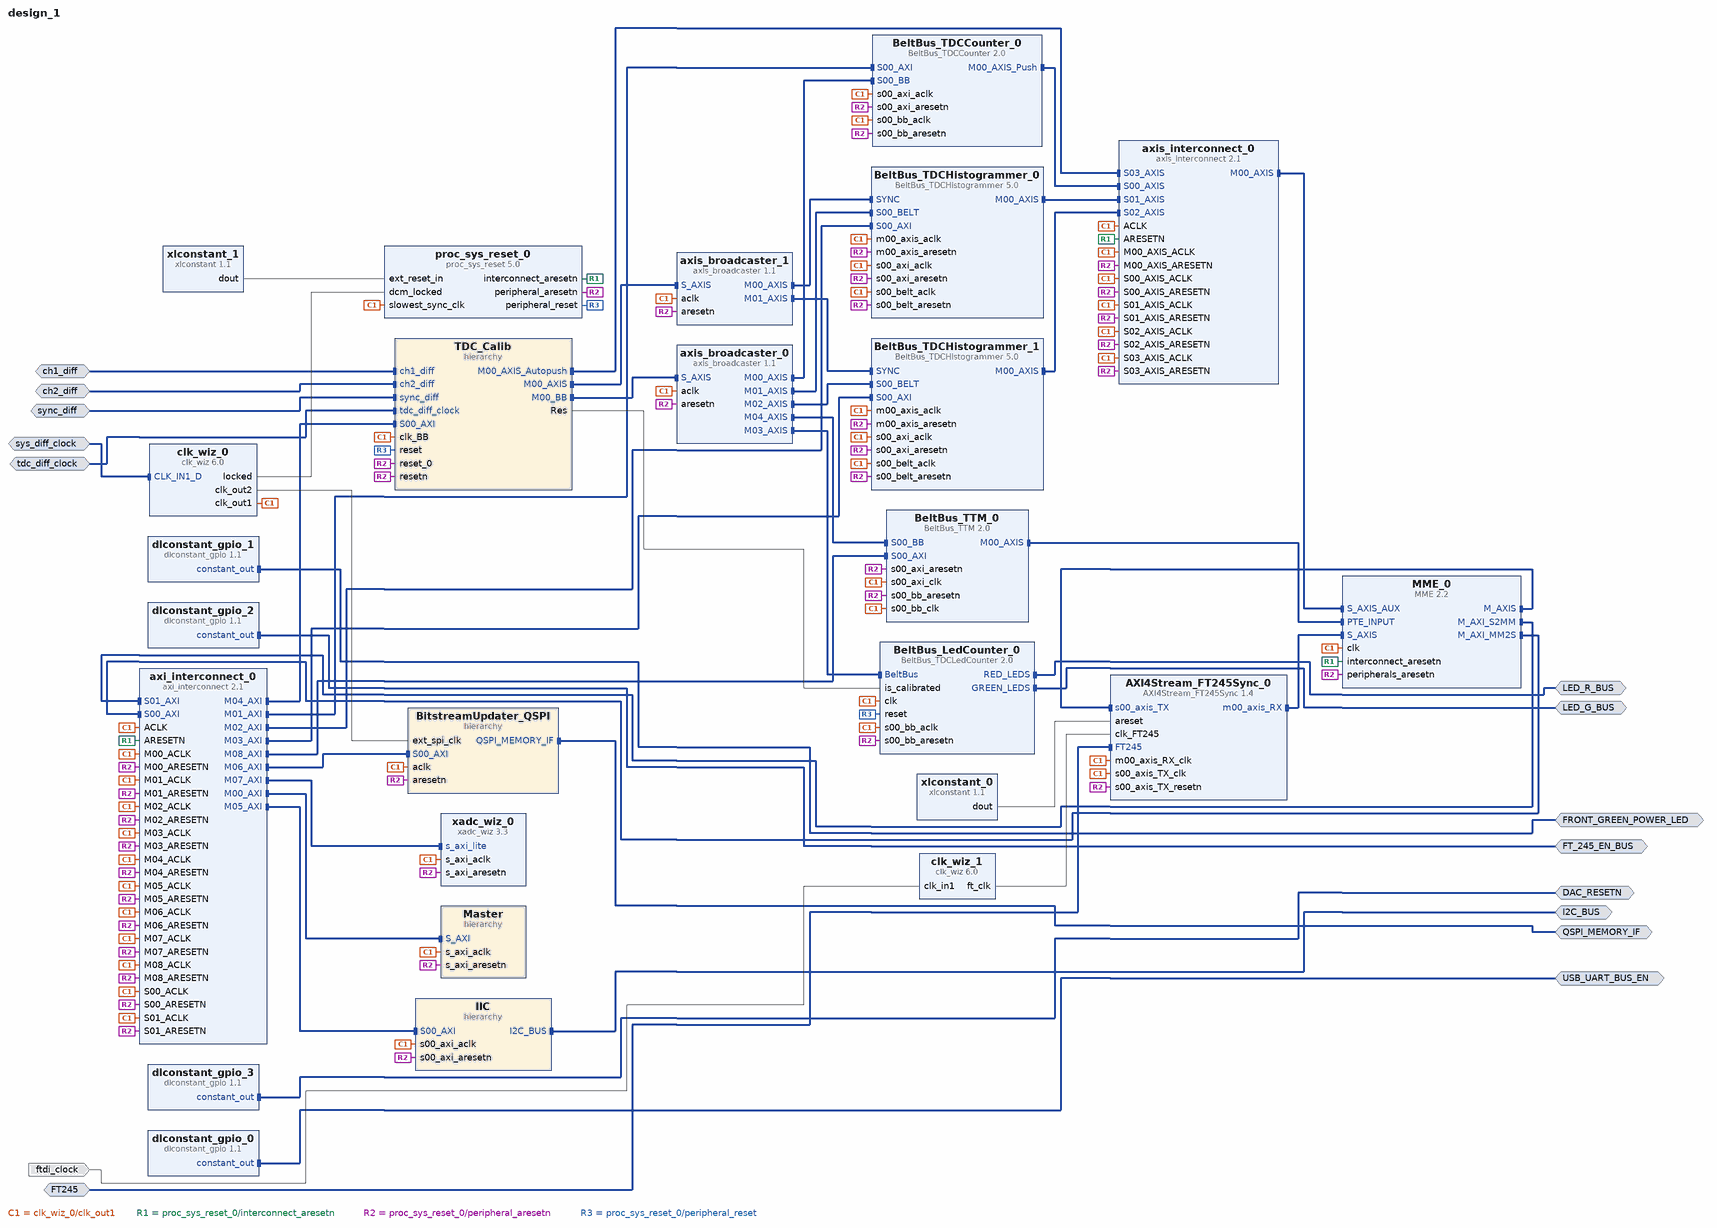
[diagram p0: block diagram of the top level]
# Vivado block design design_1, xc7a100tftg256-2, Vivado 2020.2
create_bd_design design_1

create_bd_intf_port -mode Master -vlnv xilinx.com:interface:gpio_rtl:1.0 DAC_RESETN
create_bd_intf_port -mode Master -vlnv xilinx.com:interface:gpio_rtl:1.0 FRONT_GREEN_POWER_LED
create_bd_intf_port -mode Slave -vlnv DigiLAB:if:ft245_rtl:1.2 FT245
create_bd_intf_port -mode Master -vlnv xilinx.com:interface:gpio_rtl:1.0 FT_245_EN_BUS
create_bd_intf_port -mode Master -vlnv xilinx.com:interface:iic_rtl:1.0 I2C_BUS
create_bd_intf_port -mode Master -vlnv xilinx.com:interface:gpio_rtl:1.0 LED_G_BUS
create_bd_intf_port -mode Master -vlnv xilinx.com:interface:gpio_rtl:1.0 LED_R_BUS
create_bd_intf_port -mode Master -vlnv xilinx.com:interface:spi_rtl:1.0 QSPI_MEMORY_IF
create_bd_intf_port -mode Master -vlnv xilinx.com:interface:gpio_rtl:1.0 USB_UART_BUS_EN
create_bd_intf_port -mode Slave -vlnv DigiLAB:if:diff_ch_tdc_rtl:1.1 ch1_diff
create_bd_intf_port -mode Slave -vlnv DigiLAB:if:diff_ch_tdc_rtl:1.1 ch2_diff
create_bd_intf_port -mode Slave -vlnv DigiLAB:if:diff_ch_tdc_rtl:1.1 sync_diff
create_bd_intf_port -mode Slave -vlnv xilinx.com:interface:diff_clock_rtl:1.0 sys_diff_clock
set_property -dict {CONFIG.FREQ_HZ 100000000} [get_bd_intf_ports sys_diff_clock]
create_bd_intf_port -mode Slave -vlnv xilinx.com:interface:diff_clock_rtl:1.0 tdc_diff_clock
set_property -dict {CONFIG.FREQ_HZ 416666666} [get_bd_intf_ports tdc_diff_clock]
create_bd_port -dir I -type clk ftdi_clock
set_property -dict {CONFIG.FREQ_HZ 60000000 CONFIG.PHASE 0.000} [get_bd_ports ftdi_clock]

create_bd_cell -type ip -vlnv DigiLAB:ip:AXI4Stream_FT245Sync:1.4 AXI4Stream_FT245Sync_0
set_property -dict [list \
  CONFIG.FT245_BOARD_INTERFACE FT245 \
  CONFIG.RX_BUFFER_DEPTH 512 \
  CONFIG.TX_BUFFER_DEPTH 512 \
] [get_bd_cells AXI4Stream_FT245Sync_0]
create_bd_cell -type ip -vlnv DigiLAB:ip:BeltBus_TDCLedCounter:2.0 BeltBus_LedCounter_0
set_property -dict [list \
  CONFIG.GREEN_LEDS_BOARD_INTERFACE LED_G_BUS \
  CONFIG.RED_LEDS_BOARD_INTERFACE LED_R_BUS \
] [get_bd_cells BeltBus_LedCounter_0]
create_bd_cell -type ip -vlnv DigiLAB:ip:BeltBus_TDCCounter:2.0 BeltBus_TDCCounter_0
set_property -dict {CONFIG.NUM_CH 3} [get_bd_cells BeltBus_TDCCounter_0]
create_bd_cell -type ip -vlnv DigiLAB:ip:BeltBus_TDCHistogrammer:5.0 BeltBus_TDCHistogrammer_0
set_property -dict [list \
  CONFIG.BIN_ADDR_WIDTH 13 \
  CONFIG.BIN_DATA_WIDTH 27 \
  CONFIG.BIT_OVERFLOW 16 \
  CONFIG.NUM_CH 3 \
] [get_bd_cells BeltBus_TDCHistogrammer_0]
create_bd_cell -type ip -vlnv DigiLAB:ip:BeltBus_TDCHistogrammer:5.0 BeltBus_TDCHistogrammer_1
set_property -dict [list \
  CONFIG.BIN_ADDR_WIDTH 13 \
  CONFIG.BIN_DATA_WIDTH 27 \
  CONFIG.BIT_OVERFLOW 16 \
  CONFIG.NUM_CH 3 \
] [get_bd_cells BeltBus_TDCHistogrammer_1]
create_bd_cell -type ip -vlnv DigiLAB:ip:BeltBus_TTM:2.0 BeltBus_TTM_0
set_property -dict [list \
  CONFIG.CUSTOM_TRESHOLD false \
  CONFIG.INS_TIMEOUT_CYCLES 100000000 \
  CONFIG.TAIL_FIFO_DEPTH 16384 \
  CONFIG.TLAST_GEN_TIMEOUT_CYCLES 30 \
] [get_bd_cells BeltBus_TTM_0]
create_bd_cell -type hier BitstreamUpdater_QSPI
create_bd_cell -type hier IIC
create_bd_cell -type ip -vlnv DigiLAB:hier:MME:2.2 MME_0
set_property -dict {CONFIG.MAX_PACKET_LENGTH_PACKETIZER 131072 CONFIG.PTE_AUXILIARY_PORTS true} [get_bd_cells MME_0]
create_bd_cell -type hier Master
create_bd_cell -type hier TDC_Calib
create_bd_cell -type ip -vlnv xilinx.com:ip:axi_interconnect:2.1 axi_interconnect_0
set_property -dict {CONFIG.NUM_MI 9 CONFIG.NUM_SI 2} [get_bd_cells axi_interconnect_0]
create_bd_cell -type ip -vlnv xilinx.com:ip:axis_broadcaster:1.1 axis_broadcaster_0
set_property -dict [list \
  CONFIG.HAS_TREADY 0 \
  CONFIG.M00_TDATA_REMAP {tdata[31:0]} \
  CONFIG.M01_TDATA_REMAP {tdata[31:0]} \
  CONFIG.M02_TDATA_REMAP {tdata[31:0]} \
  CONFIG.M03_TDATA_REMAP {tdata[31:0]} \
  CONFIG.M04_TDATA_REMAP {tdata[31:0]} \
  CONFIG.M_TDATA_NUM_BYTES 4 \
  CONFIG.NUM_MI 5 \
  CONFIG.S_TDATA_NUM_BYTES 4 \
] [get_bd_cells axis_broadcaster_0]
create_bd_cell -type ip -vlnv xilinx.com:ip:axis_broadcaster:1.1 axis_broadcaster_1
set_property -dict [list \
  CONFIG.HAS_TREADY 0 \
  CONFIG.M00_TDATA_REMAP {tdata[39:0]} \
  CONFIG.M01_TDATA_REMAP {tdata[39:0]} \
  CONFIG.M02_TDATA_REMAP {tdata[31:0]} \
  CONFIG.M03_TDATA_REMAP {tdata[31:0]} \
  CONFIG.M_TDATA_NUM_BYTES 5 \
  CONFIG.NUM_MI 2 \
  CONFIG.S_TDATA_NUM_BYTES 5 \
] [get_bd_cells axis_broadcaster_1]
create_bd_cell -type ip -vlnv xilinx.com:ip:axis_interconnect:2.1 axis_interconnect_0
set_property -dict {CONFIG.NUM_MI 1 CONFIG.NUM_SI 4} [get_bd_cells axis_interconnect_0]
create_bd_cell -type ip -vlnv xilinx.com:ip:clk_wiz:6.0 clk_wiz_0
set_property -dict [list \
  CONFIG.CLKOUT1_JITTER 144.719 \
  CONFIG.CLKOUT1_PHASE_ERROR 114.212 \
  CONFIG.CLKOUT2_JITTER 131.841 \
  CONFIG.CLKOUT2_PHASE_ERROR 114.212 \
  CONFIG.CLKOUT2_REQUESTED_OUT_FREQ 160.000 \
  CONFIG.CLKOUT2_USED true \
  CONFIG.CLK_IN1_BOARD_INTERFACE sys_diff_clock \
  CONFIG.MMCM_CLKFBOUT_MULT_F 8.000 \
  CONFIG.MMCM_CLKOUT0_DIVIDE_F 8.000 \
  CONFIG.MMCM_CLKOUT1_DIVIDE 5 \
  CONFIG.NUM_OUT_CLKS 2 \
  CONFIG.PRIM_SOURCE Differential_clock_capable_pin \
  CONFIG.USE_BOARD_FLOW true \
  CONFIG.USE_RESET false \
] [get_bd_cells clk_wiz_0]
create_bd_cell -type ip -vlnv xilinx.com:ip:clk_wiz:6.0 clk_wiz_1
set_property -dict [list \
  CONFIG.CLKIN1_JITTER_PS 166.66 \
  CONFIG.CLKOUT1_DRIVES BUFGCE \
  CONFIG.CLKOUT1_JITTER 165.633 \
  CONFIG.CLKOUT1_PHASE_ERROR 117.553 \
  CONFIG.CLKOUT1_REQUESTED_OUT_FREQ 60.000 \
  CONFIG.CLKOUT2_DRIVES BUFGCE \
  CONFIG.CLKOUT2_REQUESTED_OUT_FREQ 60.000 \
  CONFIG.CLKOUT3_DRIVES BUFGCE \
  CONFIG.CLKOUT3_REQUESTED_OUT_FREQ 60.000 \
  CONFIG.CLKOUT4_DRIVES BUFGCE \
  CONFIG.CLKOUT4_REQUESTED_OUT_FREQ 60.000 \
  CONFIG.CLKOUT5_DRIVES BUFGCE \
  CONFIG.CLKOUT5_REQUESTED_OUT_FREQ 60.000 \
  CONFIG.CLKOUT6_DRIVES BUFGCE \
  CONFIG.CLKOUT6_REQUESTED_OUT_FREQ 60.000 \
  CONFIG.CLKOUT7_DRIVES BUFGCE \
  CONFIG.CLKOUT7_REQUESTED_OUT_FREQ 60.000 \
  CONFIG.CLK_IN1_BOARD_INTERFACE ftdi_clock \
  CONFIG.CLK_OUT1_PORT ft_clk \
  CONFIG.FEEDBACK_SOURCE FDBK_AUTO \
  CONFIG.MMCM_CLKFBOUT_MULT_F 16.625 \
  CONFIG.MMCM_CLKIN1_PERIOD 16.667 \
  CONFIG.MMCM_CLKIN2_PERIOD 10.0 \
  CONFIG.MMCM_CLKOUT0_DIVIDE_F 16.625 \
  CONFIG.MMCM_DIVCLK_DIVIDE 1 \
  CONFIG.USE_BOARD_FLOW true \
  CONFIG.USE_FREQ_SYNTH false \
  CONFIG.USE_LOCKED false \
  CONFIG.USE_RESET false \
  CONFIG.USE_SAFE_CLOCK_STARTUP true \
] [get_bd_cells clk_wiz_1]
create_bd_cell -type ip -vlnv DigiLAB:ip:dlconstant_gpio:1.1 dlconstant_gpio_0
set_property -dict {CONFIG.CONSTANT_BOARD_INTERFACE USB_UART_BUS_EN} [get_bd_cells dlconstant_gpio_0]
create_bd_cell -type ip -vlnv DigiLAB:ip:dlconstant_gpio:1.1 dlconstant_gpio_1
set_property -dict {CONFIG.CONSTANT_BOARD_INTERFACE FRONT_GREEN_POWER_LED} [get_bd_cells dlconstant_gpio_1]
create_bd_cell -type ip -vlnv DigiLAB:ip:dlconstant_gpio:1.1 dlconstant_gpio_2
set_property -dict {CONFIG.CONSTANT_BOARD_INTERFACE FT_245_EN_BUS} [get_bd_cells dlconstant_gpio_2]
create_bd_cell -type ip -vlnv DigiLAB:ip:dlconstant_gpio:1.1 dlconstant_gpio_3
set_property -dict {CONFIG.CONSTANT_BOARD_INTERFACE DAC_RESETN} [get_bd_cells dlconstant_gpio_3]
create_bd_cell -type ip -vlnv xilinx.com:ip:proc_sys_reset:5.0 proc_sys_reset_0
create_bd_cell -type ip -vlnv xilinx.com:ip:xadc_wiz:3.3 xadc_wiz_0
set_property -dict [list \
  CONFIG.ACQUISITION_TIME 4 \
  CONFIG.ADC_CONVERSION_RATE 39 \
  CONFIG.CHANNEL_AVERAGING 256 \
  CONFIG.CHANNEL_ENABLE_TEMPERATURE true \
  CONFIG.CHANNEL_ENABLE_VP_VN false \
  CONFIG.DCLK_FREQUENCY 8 \
  CONFIG.EXTERNAL_MUX_CHANNEL VP_VN \
  CONFIG.OT_ALARM false \
  CONFIG.SEQUENCER_MODE Continuous \
  CONFIG.SINGLE_CHANNEL_ACQUISITION_TIME false \
  CONFIG.SINGLE_CHANNEL_ENABLE_CALIBRATION true \
  CONFIG.SINGLE_CHANNEL_SELECTION VP_VN \
  CONFIG.USER_TEMP_ALARM false \
  CONFIG.VCCAUX_ALARM false \
  CONFIG.VCCINT_ALARM false \
  CONFIG.XADC_STARUP_SELECTION channel_sequencer \
] [get_bd_cells xadc_wiz_0]
create_bd_cell -type ip -vlnv xilinx.com:ip:xlconstant:1.1 xlconstant_0
set_property -dict {CONFIG.CONST_VAL 0} [get_bd_cells xlconstant_0]
create_bd_cell -type ip -vlnv xilinx.com:ip:xlconstant:1.1 xlconstant_1
set_property -dict {CONFIG.CONST_VAL 1} [get_bd_cells xlconstant_1]

# ---- hierarchy /BitstreamUpdater_QSPI ----
current_bd_instance /BitstreamUpdater_QSPI
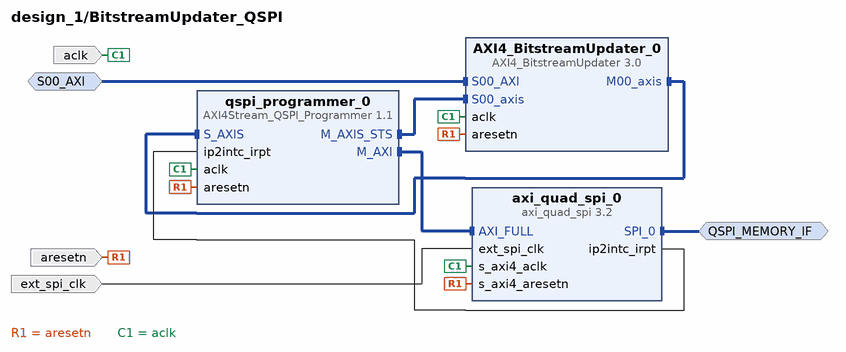
[diagram p1: block diagram inside /BitstreamUpdater_QSPI]
create_bd_intf_pin -mode Master -vlnv xilinx.com:interface:spi_rtl:1.0 QSPI_MEMORY_IF
create_bd_intf_pin -mode Slave -vlnv xilinx.com:interface:aximm_rtl:1.0 S00_AXI
create_bd_pin -dir I -type clk aclk
create_bd_pin -dir I -type rst aresetn
create_bd_pin -dir I -type clk ext_spi_clk

create_bd_cell -type ip -vlnv DigiLAB:ip:AXI4_BitstreamUpdater:3.0 AXI4_BitstreamUpdater_0
create_bd_cell -type ip -vlnv xilinx.com:ip:axi_quad_spi:3.2 axi_quad_spi_0
set_property -dict [list \
  CONFIG.C_FIFO_DEPTH 256 \
  CONFIG.C_SPI_MEMORY 3 \
  CONFIG.C_SPI_MODE 2 \
  CONFIG.C_TYPE_OF_AXI4_INTERFACE 1 \
  CONFIG.QSPI_BOARD_INTERFACE QSPI_MEMORY_IF \
  CONFIG.USE_BOARD_FLOW true \
] [get_bd_cells axi_quad_spi_0]
create_bd_cell -type ip -vlnv DigiLAB:ip:AXI4Stream_QSPI_Programmer:1.1 qspi_programmer_0
set_property -dict [list \
  CONFIG.END_ADDRESS 0x007F0000 \
  CONFIG.MEMORY_CODE S25FLxL \
  CONFIG.MEMORY_SIZE 64 \
  CONFIG.START_ADDRESS 0x00400000 \
] [get_bd_cells qspi_programmer_0]

# ---- hierarchy /IIC ----
current_bd_instance /IIC
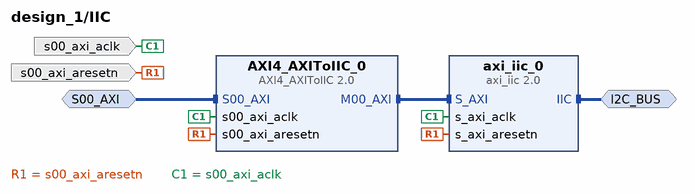
[diagram p2: block diagram inside /IIC]
create_bd_intf_pin -mode Master -vlnv xilinx.com:interface:iic_rtl:1.0 I2C_BUS
create_bd_intf_pin -mode Slave -vlnv xilinx.com:interface:aximm_rtl:1.0 S00_AXI
create_bd_pin -dir I -type clk s00_axi_aclk
create_bd_pin -dir I -type rst s00_axi_aresetn

create_bd_cell -type ip -vlnv DigiLAB:ip:AXI4_AXIToIIC:2.0 AXI4_AXIToIIC_0
create_bd_cell -type ip -vlnv xilinx.com:ip:axi_iic:2.0 axi_iic_0
set_property -dict {CONFIG.IIC_BOARD_INTERFACE I2C_BUS CONFIG.USE_BOARD_FLOW true} [get_bd_cells axi_iic_0]

# ---- hierarchy /Master ----
current_bd_instance /Master
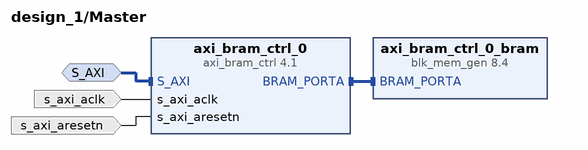
[diagram p3: block diagram inside /Master]
create_bd_intf_pin -mode Slave -vlnv xilinx.com:interface:aximm_rtl:1.0 S_AXI
create_bd_pin -dir I -type clk s_axi_aclk
create_bd_pin -dir I -type rst s_axi_aresetn

create_bd_cell -type ip -vlnv xilinx.com:ip:axi_bram_ctrl:4.1 axi_bram_ctrl_0
set_property -dict {CONFIG.SINGLE_PORT_BRAM 1} [get_bd_cells axi_bram_ctrl_0]
create_bd_cell -type ip -vlnv xilinx.com:ip:blk_mem_gen:8.4 axi_bram_ctrl_0_bram
set_property -dict [list \
  CONFIG.Coe_File ../../../../../../../../../master_v70.coe \
  CONFIG.Load_Init_File true \
  CONFIG.Memory_Type Single_Port_ROM \
  CONFIG.Port_A_Write_Rate 0 \
] [get_bd_cells axi_bram_ctrl_0_bram]

# ---- hierarchy /TDC_Calib ----
current_bd_instance /TDC_Calib
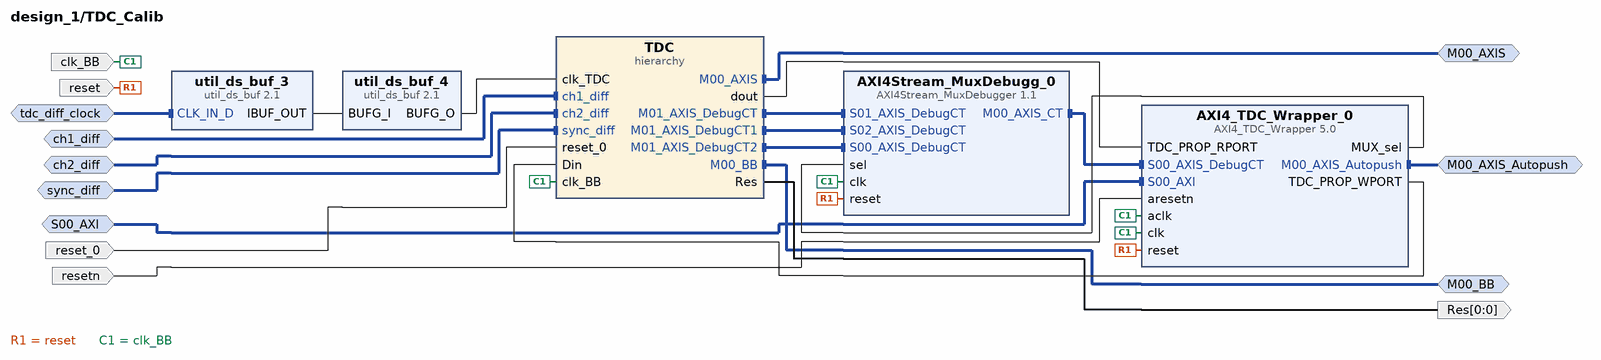
[diagram p4: block diagram inside /TDC_Calib]
create_bd_intf_pin -mode Master -vlnv xilinx.com:interface:axis_rtl:1.0 M00_AXIS
create_bd_intf_pin -mode Master -vlnv xilinx.com:interface:axis_rtl:1.0 M00_AXIS_Autopush
create_bd_intf_pin -mode Master -vlnv xilinx.com:interface:axis_rtl:1.0 M00_BB
create_bd_intf_pin -mode Slave -vlnv xilinx.com:interface:aximm_rtl:1.0 S00_AXI
create_bd_intf_pin -mode Slave -vlnv DigiLAB:if:diff_ch_tdc_rtl:1.1 ch1_diff
create_bd_intf_pin -mode Slave -vlnv DigiLAB:if:diff_ch_tdc_rtl:1.1 ch2_diff
create_bd_intf_pin -mode Slave -vlnv DigiLAB:if:diff_ch_tdc_rtl:1.1 sync_diff
create_bd_intf_pin -mode Slave -vlnv xilinx.com:interface:diff_clock_rtl:1.0 tdc_diff_clock
create_bd_pin -dir O -from 0 -to 0 Res
create_bd_pin -dir I -type clk clk_BB
create_bd_pin -dir I -type rst reset
create_bd_pin -dir I -type rst reset_0
create_bd_pin -dir I -type rst resetn

create_bd_cell -type ip -vlnv DigiLAB:ip:AXI4Stream_MuxDebugger:1.1 AXI4Stream_MuxDebugg_0
set_property -dict {CONFIG.DEBUG_MODE_CC false CONFIG.NUM_CHANNEL 3} [get_bd_cells AXI4Stream_MuxDebugg_0]
create_bd_cell -type ip -vlnv DigiLAB:ip:AXI4_TDC_Wrapper:5.0 AXI4_TDC_Wrapper_0
set_property -dict [list \
  CONFIG.BIT_CALIBRATION 24 \
  CONFIG.BIT_RESOLUTION 16 \
  CONFIG.BIT_UNCALIBRATED 10 \
  CONFIG.C_S00_AXI_ADDR_ABS 0x44A40000 \
  CONFIG.DEBUG_MODE_CC false \
  CONFIG.DEF_CH_STRETCHERLENGTH 6 \
  CONFIG.DEF_SYNC_STRETCHERLENGTH 1 \
  CONFIG.PW_StretcherLength 3 \
  CONFIG.TDC_CH_RPORT_WIDTH 65 \
  CONFIG.TDC_ENABLE_DEBUG_PORTS false \
] [get_bd_cells AXI4_TDC_Wrapper_0]
create_bd_cell -type hier TDC
create_bd_cell -type ip -vlnv xilinx.com:ip:util_ds_buf:2.1 util_ds_buf_3
set_property -dict {CONFIG.DIFF_CLK_IN_BOARD_INTERFACE tdc_diff_clock CONFIG.USE_BOARD_FLOW true} [get_bd_cells util_ds_buf_3]
create_bd_cell -type ip -vlnv xilinx.com:ip:util_ds_buf:2.1 util_ds_buf_4
set_property -dict {CONFIG.C_BUF_TYPE BUFG} [get_bd_cells util_ds_buf_4]

# ---- hierarchy /TDC_Calib/TDC ----
current_bd_instance /TDC_Calib/TDC
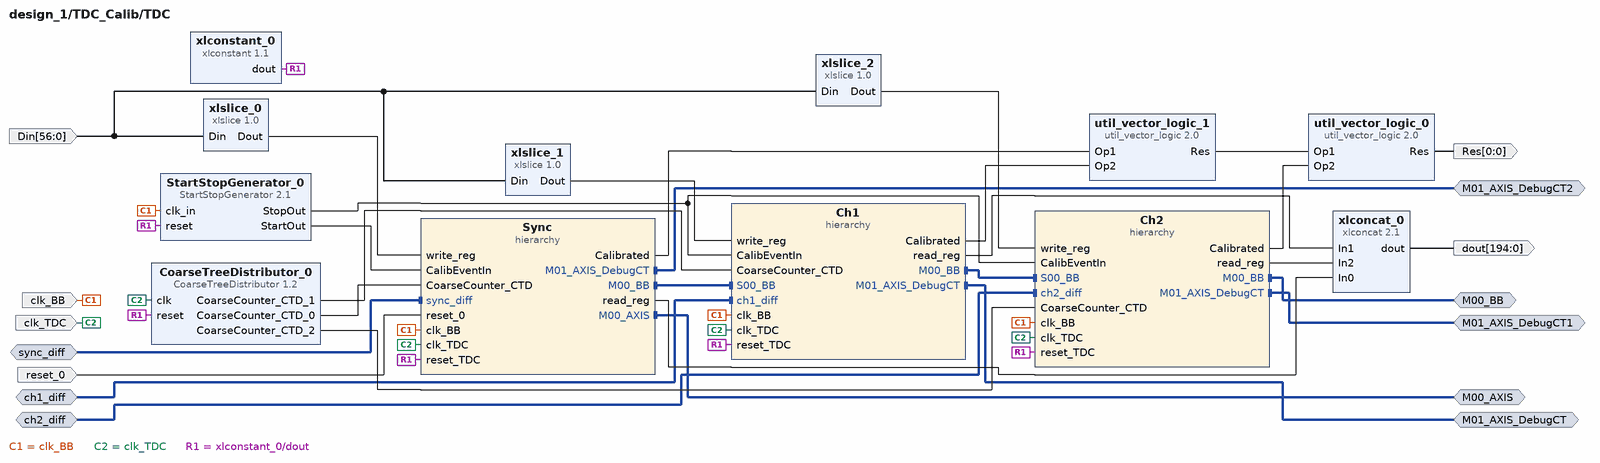
[diagram p5: block diagram inside /TDC_Calib/TDC]
create_bd_intf_pin -mode Master -vlnv xilinx.com:interface:axis_rtl:1.0 M00_AXIS
create_bd_intf_pin -mode Master -vlnv xilinx.com:interface:axis_rtl:1.0 M00_BB
create_bd_intf_pin -mode Master -vlnv xilinx.com:interface:axis_rtl:1.0 M01_AXIS_DebugCT
create_bd_intf_pin -mode Master -vlnv xilinx.com:interface:axis_rtl:1.0 M01_AXIS_DebugCT1
create_bd_intf_pin -mode Master -vlnv xilinx.com:interface:axis_rtl:1.0 M01_AXIS_DebugCT2
create_bd_intf_pin -mode Slave -vlnv DigiLAB:if:diff_ch_tdc_rtl:1.1 ch1_diff
create_bd_intf_pin -mode Slave -vlnv DigiLAB:if:diff_ch_tdc_rtl:1.1 ch2_diff
create_bd_intf_pin -mode Slave -vlnv DigiLAB:if:diff_ch_tdc_rtl:1.1 sync_diff
create_bd_pin -dir I -from 56 -to 0 Din
create_bd_pin -dir O -from 0 -to 0 Res
create_bd_pin -dir I -type clk clk_BB
create_bd_pin -dir I -type clk clk_TDC
create_bd_pin -dir O -from 194 -to 0 dout
create_bd_pin -dir I -type rst reset_0

create_bd_cell -type hier Ch1
create_bd_cell -type hier Ch2
create_bd_cell -type ip -vlnv DigiLAB:ip:CoarseTreeDistributor:1.2 CoarseTreeDistributor_0
set_property -dict {CONFIG.NUMBER_OF_OUTPUT 3} [get_bd_cells CoarseTreeDistributor_0]
create_bd_cell -type ip -vlnv DigiLAB:ip:StartStopGenerator:2.1 StartStopGenerator_0
set_property -dict {CONFIG.CLK_SELECT EXTERNAL CONFIG.HALF_DIVIDER 5 CONFIG.TUNING_MODE false} [get_bd_cells StartStopGenerator_0]
create_bd_cell -type hier Sync
create_bd_cell -type ip -vlnv xilinx.com:ip:util_vector_logic:2.0 util_vector_logic_0
set_property -dict {CONFIG.C_SIZE 1} [get_bd_cells util_vector_logic_0]
create_bd_cell -type ip -vlnv xilinx.com:ip:util_vector_logic:2.0 util_vector_logic_1
set_property -dict {CONFIG.C_SIZE 1} [get_bd_cells util_vector_logic_1]
create_bd_cell -type ip -vlnv xilinx.com:ip:xlconcat:2.1 xlconcat_0
set_property -dict {CONFIG.IN0_WIDTH 65 CONFIG.IN1_WIDTH 65 CONFIG.IN2_WIDTH 65 CONFIG.NUM_PORTS 3} [get_bd_cells xlconcat_0]
create_bd_cell -type ip -vlnv xilinx.com:ip:xlconstant:1.1 xlconstant_0
set_property -dict {CONFIG.CONST_VAL 0} [get_bd_cells xlconstant_0]
create_bd_cell -type ip -vlnv xilinx.com:ip:xlslice:1.0 xlslice_0
set_property -dict {CONFIG.DIN_FROM 18 CONFIG.DIN_WIDTH 57 CONFIG.DOUT_WIDTH 19} [get_bd_cells xlslice_0]
create_bd_cell -type ip -vlnv xilinx.com:ip:xlslice:1.0 xlslice_1
set_property -dict {CONFIG.DIN_FROM 37 CONFIG.DIN_TO 19 CONFIG.DIN_WIDTH 57 CONFIG.DOUT_WIDTH 19} [get_bd_cells xlslice_1]
create_bd_cell -type ip -vlnv xilinx.com:ip:xlslice:1.0 xlslice_2
set_property -dict {CONFIG.DIN_FROM 56 CONFIG.DIN_TO 38 CONFIG.DIN_WIDTH 57 CONFIG.DOUT_WIDTH 19} [get_bd_cells xlslice_2]

# ---- hierarchy /TDC_Calib/TDC/Ch1 ----
current_bd_instance /TDC_Calib/TDC/Ch1
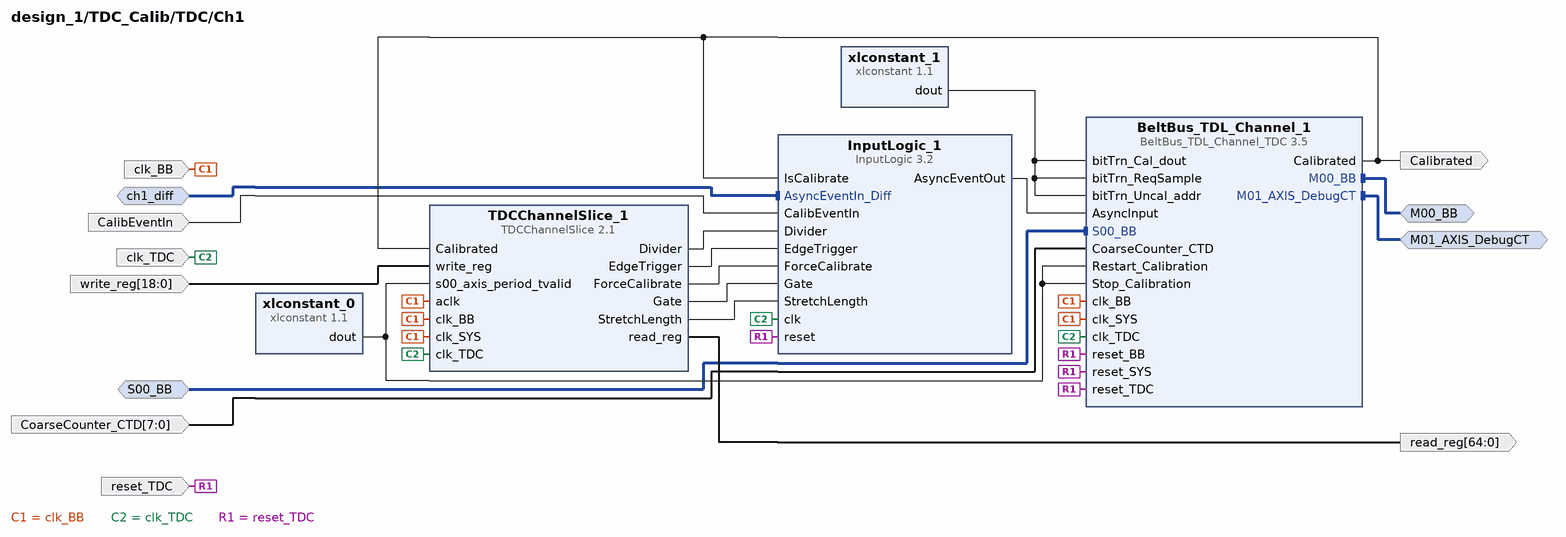
[diagram p6: block diagram inside /TDC_Calib/TDC/Ch1]
create_bd_intf_pin -mode Master -vlnv xilinx.com:interface:axis_rtl:1.0 M00_BB
create_bd_intf_pin -mode Master -vlnv xilinx.com:interface:axis_rtl:1.0 M01_AXIS_DebugCT
create_bd_intf_pin -mode Slave -vlnv xilinx.com:interface:axis_rtl:1.0 S00_BB
create_bd_intf_pin -mode Slave -vlnv DigiLAB:if:diff_ch_tdc_rtl:1.1 ch1_diff
create_bd_pin -dir I -type data CalibEventIn
create_bd_pin -dir O -type data Calibrated
create_bd_pin -dir I -from 7 -to 0 CoarseCounter_CTD
create_bd_pin -dir I -type clk clk_BB
create_bd_pin -dir I -type clk clk_TDC
create_bd_pin -dir O -from 64 -to 0 -type data read_reg
create_bd_pin -dir I -type rst reset_TDC
create_bd_pin -dir I -from 18 -to 0 -type data write_reg

create_bd_cell -type ip -vlnv DigiLAB:hier:BeltBus_TDL_Channel_TDC:3.5 BeltBus_TDL_Channel_1
set_property -dict [list \
  CONFIG.BIT_SMP_PRE_TDL 0 \
  CONFIG.BIT_UNCALIBRATED 10 \
  CONFIG.CEC_VS_CTD_COUNTER CTD \
  CONFIG.DEBUG_MODE false \
  CONFIG.DEBUG_MODE_CT true \
  CONFIG.DEBUG_PORT_DECODER false \
  CONFIG.NUMBER_OF_TDL 4 \
  CONFIG.NUM_CH 1 \
  CONFIG.NUM_NODE 1 \
  CONFIG.NUM_TAP_PRE_TDL 0 \
] [get_bd_cells BeltBus_TDL_Channel_1]
create_bd_cell -type ip -vlnv DigiLAB:ip:InputLogic:3.2 InputLogic_1
set_property -dict [list \
  CONFIG.BIT_DIVIDER 4 \
  CONFIG.BIT_STRETCH_LENGTH 3 \
  CONFIG.CALIB_EVENT EXTERNAL \
  CONFIG.DIVIDER_INIT 0 \
  CONFIG.EDGE_TRIGGER_INIT RISE \
  CONFIG.INPUT_DIFF_CH_TDC_BOARD_INTERFACE ch1_diff \
  CONFIG.INVERT_BUFFER_POLARITY true \
  CONFIG.STRETCH_LENGTH_INIT 6 \
  CONFIG.TUNING_MODE true \
] [get_bd_cells InputLogic_1]
create_bd_cell -type ip -vlnv DigiLAB:ip:TDCChannelSlice:2.1 TDCChannelSlice_1
set_property -dict {CONFIG.BIT_DIVIDER 4 CONFIG.TDC_ENABLE_DEBUG_PORTS false} [get_bd_cells TDCChannelSlice_1]
create_bd_cell -type ip -vlnv xilinx.com:ip:xlconstant:1.1 xlconstant_0
set_property -dict {CONFIG.CONST_VAL 0} [get_bd_cells xlconstant_0]
create_bd_cell -type ip -vlnv xilinx.com:ip:xlconstant:1.1 xlconstant_1
set_property -dict {CONFIG.CONST_VAL 0 CONFIG.CONST_WIDTH 32} [get_bd_cells xlconstant_1]

# ---- hierarchy /TDC_Calib/TDC/Ch2 ----
current_bd_instance /TDC_Calib/TDC/Ch2
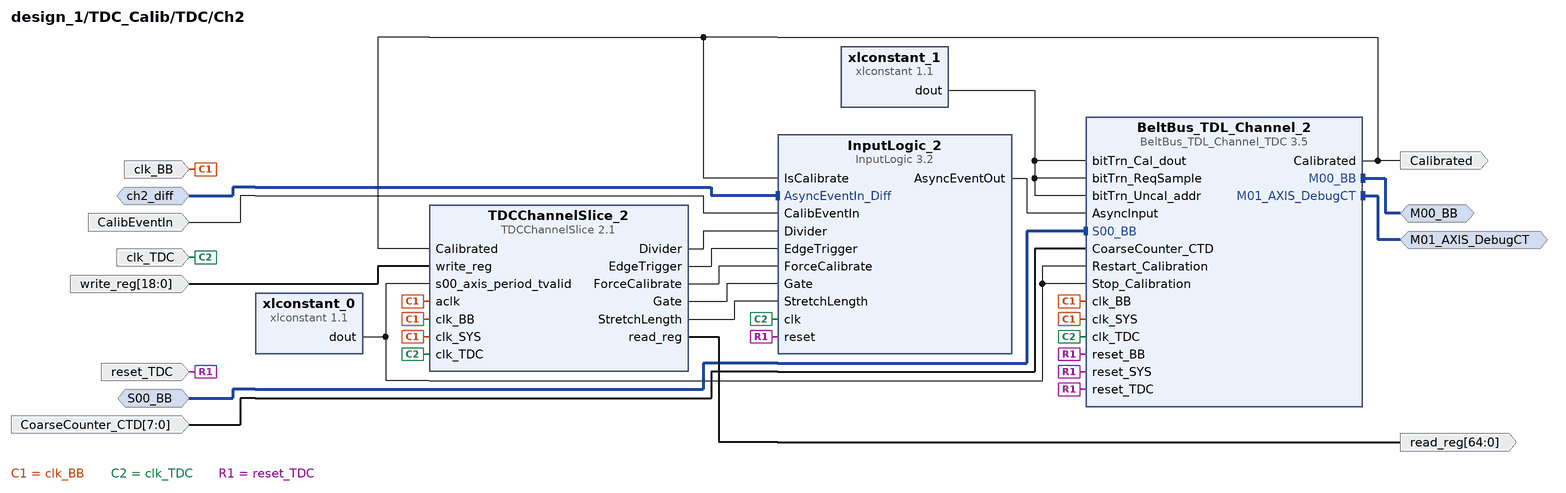
[diagram p7: block diagram inside /TDC_Calib/TDC/Ch2]
create_bd_intf_pin -mode Master -vlnv xilinx.com:interface:axis_rtl:1.0 M00_BB
create_bd_intf_pin -mode Master -vlnv xilinx.com:interface:axis_rtl:1.0 M01_AXIS_DebugCT
create_bd_intf_pin -mode Slave -vlnv xilinx.com:interface:axis_rtl:1.0 S00_BB
create_bd_intf_pin -mode Slave -vlnv DigiLAB:if:diff_ch_tdc_rtl:1.1 ch2_diff
create_bd_pin -dir I -type data CalibEventIn
create_bd_pin -dir O -type data Calibrated
create_bd_pin -dir I -from 7 -to 0 CoarseCounter_CTD
create_bd_pin -dir I -type clk clk_BB
create_bd_pin -dir I -type clk clk_TDC
create_bd_pin -dir O -from 64 -to 0 -type data read_reg
create_bd_pin -dir I -type rst reset_TDC
create_bd_pin -dir I -from 18 -to 0 -type data write_reg

create_bd_cell -type ip -vlnv DigiLAB:hier:BeltBus_TDL_Channel_TDC:3.5 BeltBus_TDL_Channel_2
set_property -dict [list \
  CONFIG.BIT_SMP_PRE_TDL 0 \
  CONFIG.BIT_UNCALIBRATED 10 \
  CONFIG.CEC_VS_CTD_COUNTER CTD \
  CONFIG.DEBUG_MODE false \
  CONFIG.DEBUG_MODE_CT true \
  CONFIG.DEBUG_PORT_DECODER false \
  CONFIG.NUMBER_OF_TDL 4 \
  CONFIG.NUM_CH 2 \
  CONFIG.NUM_NODE 2 \
  CONFIG.NUM_TAP_PRE_TDL 0 \
] [get_bd_cells BeltBus_TDL_Channel_2]
create_bd_cell -type ip -vlnv DigiLAB:ip:InputLogic:3.2 InputLogic_2
set_property -dict [list \
  CONFIG.BIT_DIVIDER 4 \
  CONFIG.BIT_STRETCH_LENGTH 3 \
  CONFIG.CALIB_EVENT EXTERNAL \
  CONFIG.DIVIDER_INIT 0 \
  CONFIG.EDGE_TRIGGER_INIT RISE \
  CONFIG.INPUT_DIFF_CH_TDC_BOARD_INTERFACE ch2_diff \
  CONFIG.INVERT_BUFFER_POLARITY true \
  CONFIG.STRETCH_LENGTH_INIT 6 \
  CONFIG.TUNING_MODE true \
] [get_bd_cells InputLogic_2]
create_bd_cell -type ip -vlnv DigiLAB:ip:TDCChannelSlice:2.1 TDCChannelSlice_2
set_property -dict {CONFIG.BIT_DIVIDER 4 CONFIG.TDC_ENABLE_DEBUG_PORTS false} [get_bd_cells TDCChannelSlice_2]
create_bd_cell -type ip -vlnv xilinx.com:ip:xlconstant:1.1 xlconstant_0
set_property -dict {CONFIG.CONST_VAL 0} [get_bd_cells xlconstant_0]
create_bd_cell -type ip -vlnv xilinx.com:ip:xlconstant:1.1 xlconstant_1
set_property -dict {CONFIG.CONST_VAL 0 CONFIG.CONST_WIDTH 32} [get_bd_cells xlconstant_1]

# ---- hierarchy /TDC_Calib/TDC/Sync ----
current_bd_instance /TDC_Calib/TDC/Sync
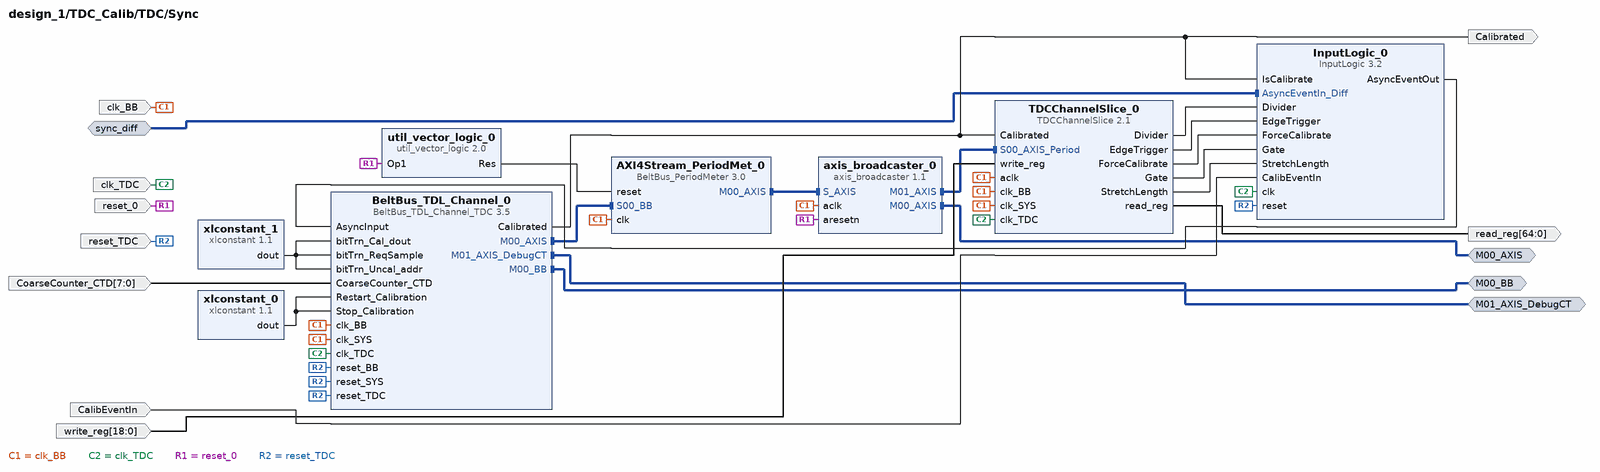
[diagram p8: block diagram inside /TDC_Calib/TDC/Sync]
create_bd_intf_pin -mode Master -vlnv xilinx.com:interface:axis_rtl:1.0 M00_AXIS
create_bd_intf_pin -mode Master -vlnv xilinx.com:interface:axis_rtl:1.0 M00_BB
create_bd_intf_pin -mode Master -vlnv xilinx.com:interface:axis_rtl:1.0 M01_AXIS_DebugCT
create_bd_intf_pin -mode Slave -vlnv DigiLAB:if:diff_ch_tdc_rtl:1.1 sync_diff
create_bd_pin -dir I -type data CalibEventIn
create_bd_pin -dir O -type data Calibrated
create_bd_pin -dir I -from 7 -to 0 CoarseCounter_CTD
create_bd_pin -dir I -type clk clk_BB
create_bd_pin -dir I -type clk clk_TDC
create_bd_pin -dir O -from 64 -to 0 -type data read_reg
create_bd_pin -dir I -type rst reset_0
create_bd_pin -dir I -type rst reset_TDC
create_bd_pin -dir I -from 18 -to 0 -type data write_reg

create_bd_cell -type ip -vlnv DigiLAB:ip:BeltBus_PeriodMeter:3.0 AXI4Stream_PeriodMet_0
set_property -dict {CONFIG.BIT_COARSE 8 CONFIG.BIT_OVERFLOW 16} [get_bd_cells AXI4Stream_PeriodMet_0]
create_bd_cell -type ip -vlnv DigiLAB:hier:BeltBus_TDL_Channel_TDC:3.5 BeltBus_TDL_Channel_0
set_property -dict [list \
  CONFIG.BIT_SMP_PRE_TDL 0 \
  CONFIG.BIT_UNCALIBRATED 10 \
  CONFIG.CEC_VS_CTD_COUNTER CTD \
  CONFIG.DEBUG_MODE false \
  CONFIG.DEBUG_MODE_CT true \
  CONFIG.DEBUG_PORT_DECODER false \
  CONFIG.NUMBER_OF_TDL 4 \
  CONFIG.NUM_TAP_PRE_TDL 0 \
  CONFIG.PASS_THROUGH Both \
] [get_bd_cells BeltBus_TDL_Channel_0]
create_bd_cell -type ip -vlnv DigiLAB:ip:InputLogic:3.2 InputLogic_0
set_property -dict [list \
  CONFIG.BIT_DIVIDER 4 \
  CONFIG.BIT_STRETCH_LENGTH 3 \
  CONFIG.CALIB_EVENT EXTERNAL \
  CONFIG.DIVIDER_INIT 15 \
  CONFIG.INPUT_DIFF_CH_TDC_BOARD_INTERFACE sync_diff \
  CONFIG.STRETCH_LENGTH_INIT 6 \
  CONFIG.TUNING_MODE true \
] [get_bd_cells InputLogic_0]
create_bd_cell -type ip -vlnv DigiLAB:ip:TDCChannelSlice:2.1 TDCChannelSlice_0
set_property -dict [list \
  CONFIG.BIT_DIVIDER 4 \
  CONFIG.BIT_OVERFLOW 16 \
  CONFIG.TDC_ENABLE_DEBUG_PORTS false \
] [get_bd_cells TDCChannelSlice_0]
create_bd_cell -type ip -vlnv xilinx.com:ip:axis_broadcaster:1.1 axis_broadcaster_0
set_property -dict [list \
  CONFIG.HAS_TREADY 0 \
  CONFIG.M00_TDATA_REMAP {tdata[39:0]} \
  CONFIG.M01_TDATA_REMAP {tdata[39:0]} \
  CONFIG.M_TDATA_NUM_BYTES 5 \
  CONFIG.S_TDATA_NUM_BYTES 5 \
] [get_bd_cells axis_broadcaster_0]
create_bd_cell -type ip -vlnv xilinx.com:ip:util_vector_logic:2.0 util_vector_logic_0
set_property -dict {CONFIG.C_OPERATION not CONFIG.C_SIZE 1} [get_bd_cells util_vector_logic_0]
create_bd_cell -type ip -vlnv xilinx.com:ip:xlconstant:1.1 xlconstant_0
set_property -dict {CONFIG.CONST_VAL 0} [get_bd_cells xlconstant_0]
create_bd_cell -type ip -vlnv xilinx.com:ip:xlconstant:1.1 xlconstant_1
set_property -dict {CONFIG.CONST_VAL 0 CONFIG.CONST_WIDTH 32} [get_bd_cells xlconstant_1]

# ---- connections ----

current_bd_instance /BitstreamUpdater_QSPI
connect_bd_intf_net [get_bd_intf_pins AXI4_BitstreamUpdater_0/M00_axis] [get_bd_intf_pins qspi_programmer_0/S_AXIS]
connect_bd_intf_net -intf_net axi_interconnect_0_M06_AXI [get_bd_intf_pins S00_AXI] [get_bd_intf_pins AXI4_BitstreamUpdater_0/S00_AXI]
connect_bd_intf_net [get_bd_intf_pins axi_quad_spi_0/AXI_FULL] [get_bd_intf_pins qspi_programmer_0/M_AXI]
connect_bd_intf_net [get_bd_intf_pins QSPI_MEMORY_IF] [get_bd_intf_pins axi_quad_spi_0/SPI_0]
connect_bd_intf_net [get_bd_intf_pins AXI4_BitstreamUpdater_0/S00_axis] [get_bd_intf_pins qspi_programmer_0/M_AXIS_STS]
connect_bd_net [get_bd_pins aresetn] \
  [get_bd_pins AXI4_BitstreamUpdater_0/aresetn] [get_bd_pins axi_quad_spi_0/s_axi4_aresetn] \
  [get_bd_pins qspi_programmer_0/aresetn]
connect_bd_net [get_bd_pins axi_quad_spi_0/ip2intc_irpt] [get_bd_pins qspi_programmer_0/ip2intc_irpt]
connect_bd_net -net clk_wiz_0_clk_out1 [get_bd_pins aclk] \
  [get_bd_pins AXI4_BitstreamUpdater_0/aclk] [get_bd_pins axi_quad_spi_0/s_axi4_aclk] [get_bd_pins qspi_programmer_0/aclk]
connect_bd_net -net clk_wiz_0_clk_out2 [get_bd_pins ext_spi_clk] [get_bd_pins axi_quad_spi_0/ext_spi_clk]

current_bd_instance /IIC
connect_bd_intf_net [get_bd_intf_pins AXI4_AXIToIIC_0/M00_AXI] [get_bd_intf_pins axi_iic_0/S_AXI]
connect_bd_intf_net [get_bd_intf_pins I2C_BUS] [get_bd_intf_pins axi_iic_0/IIC]
connect_bd_intf_net -intf_net axi_interconnect_0_M05_AXI [get_bd_intf_pins S00_AXI] [get_bd_intf_pins AXI4_AXIToIIC_0/S00_AXI]
connect_bd_net -net M05_ARESETN_1 [get_bd_pins s00_axi_aresetn] [get_bd_pins AXI4_AXIToIIC_0/s00_axi_aresetn] [get_bd_pins axi_iic_0/s_axi_aresetn]
connect_bd_net -net clk_wiz_0_clk_out1 [get_bd_pins s00_axi_aclk] [get_bd_pins AXI4_AXIToIIC_0/s00_axi_aclk] [get_bd_pins axi_iic_0/s_axi_aclk]

current_bd_instance /Master
connect_bd_intf_net [get_bd_intf_pins axi_bram_ctrl_0/BRAM_PORTA] [get_bd_intf_pins axi_bram_ctrl_0_bram/BRAM_PORTA]
connect_bd_intf_net -intf_net axi_interconnect_0_M01_AXI [get_bd_intf_pins S_AXI] [get_bd_intf_pins axi_bram_ctrl_0/S_AXI]
connect_bd_net -net clk_wiz_0_clk_out1 [get_bd_pins s_axi_aclk] [get_bd_pins axi_bram_ctrl_0/s_axi_aclk]
connect_bd_net -net proc_sys_reset_0_peripheral_aresetn [get_bd_pins s_axi_aresetn] [get_bd_pins axi_bram_ctrl_0/s_axi_aresetn]

current_bd_instance /TDC_Calib
connect_bd_intf_net [get_bd_intf_pins AXI4Stream_MuxDebugg_0/M00_AXIS_CT] [get_bd_intf_pins AXI4_TDC_Wrapper_0/S00_AXIS_DebugCT]
connect_bd_intf_net [get_bd_intf_pins M00_AXIS_Autopush] [get_bd_intf_pins AXI4_TDC_Wrapper_0/M00_AXIS_Autopush]
connect_bd_intf_net [get_bd_intf_pins M00_AXIS] [get_bd_intf_pins TDC/M00_AXIS]
connect_bd_intf_net [get_bd_intf_pins S00_AXI] [get_bd_intf_pins AXI4_TDC_Wrapper_0/S00_AXI]
connect_bd_intf_net [get_bd_intf_pins M00_BB] [get_bd_intf_pins TDC/M00_BB]
connect_bd_intf_net [get_bd_intf_pins AXI4Stream_MuxDebugg_0/S01_AXIS_DebugCT] [get_bd_intf_pins TDC/M01_AXIS_DebugCT]
connect_bd_intf_net [get_bd_intf_pins AXI4Stream_MuxDebugg_0/S02_AXIS_DebugCT] [get_bd_intf_pins TDC/M01_AXIS_DebugCT1]
connect_bd_intf_net [get_bd_intf_pins AXI4Stream_MuxDebugg_0/S00_AXIS_DebugCT] [get_bd_intf_pins TDC/M01_AXIS_DebugCT2]
connect_bd_intf_net [get_bd_intf_pins ch1_diff] [get_bd_intf_pins TDC/ch1_diff]
connect_bd_intf_net [get_bd_intf_pins ch2_diff] [get_bd_intf_pins TDC/ch2_diff]
connect_bd_intf_net [get_bd_intf_pins sync_diff] [get_bd_intf_pins TDC/sync_diff]
connect_bd_intf_net [get_bd_intf_pins tdc_diff_clock] [get_bd_intf_pins util_ds_buf_3/CLK_IN_D]
connect_bd_net [get_bd_pins AXI4_TDC_Wrapper_0/MUX_sel] [get_bd_pins AXI4Stream_MuxDebugg_0/sel]
connect_bd_net [get_bd_pins AXI4_TDC_Wrapper_0/TDC_PROP_WPORT] [get_bd_pins TDC/Din]
connect_bd_net [get_bd_pins reset] [get_bd_pins AXI4Stream_MuxDebugg_0/reset] [get_bd_pins AXI4_TDC_Wrapper_0/reset]
connect_bd_net [get_bd_pins TDC/Res] [get_bd_pins Res]
connect_bd_net [get_bd_pins TDC/dout] [get_bd_pins AXI4_TDC_Wrapper_0/TDC_PROP_RPORT]
connect_bd_net -net clk_wiz_0_clk_out1 [get_bd_pins clk_BB] \
  [get_bd_pins AXI4Stream_MuxDebugg_0/clk] [get_bd_pins AXI4_TDC_Wrapper_0/aclk] [get_bd_pins AXI4_TDC_Wrapper_0/clk] \
  [get_bd_pins TDC/clk_BB]
connect_bd_net -net proc_sys_reset_0_peripheral_aresetn [get_bd_pins resetn] [get_bd_pins AXI4_TDC_Wrapper_0/aresetn]
connect_bd_net -net reset_0_1 [get_bd_pins reset_0] [get_bd_pins TDC/reset_0]
connect_bd_net [get_bd_pins util_ds_buf_3/IBUF_OUT] [get_bd_pins util_ds_buf_4/BUFG_I]
connect_bd_net [get_bd_pins util_ds_buf_4/BUFG_O] [get_bd_pins TDC/clk_TDC]

current_bd_instance /TDC_Calib/TDC
connect_bd_intf_net -intf_net BeltBus_TDL_Channel_0_M00_BB [get_bd_intf_pins Ch1/S00_BB] [get_bd_intf_pins Sync/M00_BB]
connect_bd_intf_net -intf_net BeltBus_TDL_Channel_0_M01_AXIS_DebugCT [get_bd_intf_pins M01_AXIS_DebugCT2] [get_bd_intf_pins Sync/M01_AXIS_DebugCT]
connect_bd_intf_net -intf_net BeltBus_TDL_Channel_1_M00_BB [get_bd_intf_pins Ch1/M00_BB] [get_bd_intf_pins Ch2/S00_BB]
connect_bd_intf_net -intf_net BeltBus_TDL_Channel_1_M01_AXIS_DebugCT [get_bd_intf_pins M01_AXIS_DebugCT] [get_bd_intf_pins Ch1/M01_AXIS_DebugCT]
connect_bd_intf_net -intf_net BeltBus_TDL_Channel_2_M00_BB [get_bd_intf_pins M00_BB] [get_bd_intf_pins Ch2/M00_BB]
connect_bd_intf_net -intf_net BeltBus_TDL_Channel_2_M01_AXIS_DebugCT [get_bd_intf_pins M01_AXIS_DebugCT1] [get_bd_intf_pins Ch2/M01_AXIS_DebugCT]
connect_bd_intf_net [get_bd_intf_pins sync_diff] [get_bd_intf_pins Sync/sync_diff]
connect_bd_intf_net [get_bd_intf_pins ch1_diff] [get_bd_intf_pins Ch1/ch1_diff]
connect_bd_intf_net [get_bd_intf_pins ch2_diff] [get_bd_intf_pins Ch2/ch2_diff]
connect_bd_intf_net [get_bd_intf_pins M00_AXIS] [get_bd_intf_pins Sync/M00_AXIS]
connect_bd_net -net BeltBus_TDL_Channel_TDC_0_Calibrated [get_bd_pins Sync/Calibrated] [get_bd_pins util_vector_logic_1/Op1]
connect_bd_net -net BeltBus_TDL_Channel_TDC_1_Calibrated [get_bd_pins Ch1/Calibrated] [get_bd_pins util_vector_logic_1/Op2]
connect_bd_net -net BeltBus_TDL_Channel_TDC_2_Calibrated [get_bd_pins Ch2/Calibrated] [get_bd_pins util_vector_logic_0/Op2]
connect_bd_net [get_bd_pins CoarseTreeDistributor_0/CoarseCounter_CTD_0] [get_bd_pins Sync/CoarseCounter_CTD]
connect_bd_net [get_bd_pins CoarseTreeDistributor_0/CoarseCounter_CTD_1] [get_bd_pins Ch1/CoarseCounter_CTD]
connect_bd_net [get_bd_pins CoarseTreeDistributor_0/CoarseCounter_CTD_2] [get_bd_pins Ch2/CoarseCounter_CTD]
connect_bd_net [get_bd_pins Din] [get_bd_pins xlslice_0/Din] [get_bd_pins xlslice_1/Din] [get_bd_pins xlslice_2/Din]
connect_bd_net [get_bd_pins StartStopGenerator_0/StartOut] [get_bd_pins Sync/CalibEventIn]
connect_bd_net [get_bd_pins StartStopGenerator_0/StopOut] [get_bd_pins Ch1/CalibEventIn] [get_bd_pins Ch2/CalibEventIn]
connect_bd_net [get_bd_pins Sync/read_reg] [get_bd_pins xlconcat_0/In0]
connect_bd_net -net TDCChannelSlice_1_read_reg [get_bd_pins Ch1/read_reg] [get_bd_pins xlconcat_0/In1]
connect_bd_net -net TDCChannelSlice_2_read_reg [get_bd_pins Ch2/read_reg] [get_bd_pins xlconcat_0/In2]
connect_bd_net [get_bd_pins clk_BB] \
  [get_bd_pins Ch1/clk_BB] [get_bd_pins Ch2/clk_BB] [get_bd_pins StartStopGenerator_0/clk_in] [get_bd_pins Sync/clk_BB]
connect_bd_net [get_bd_pins clk_TDC] \
  [get_bd_pins Ch1/clk_TDC] [get_bd_pins Ch2/clk_TDC] [get_bd_pins CoarseTreeDistributor_0/clk] [get_bd_pins Sync/clk_TDC]
connect_bd_net -net reset_0_1 [get_bd_pins reset_0] [get_bd_pins Sync/reset_0]
connect_bd_net -net reset_TDC_1 [get_bd_pins xlconstant_0/dout] \
  [get_bd_pins Ch1/reset_TDC] [get_bd_pins Ch2/reset_TDC] [get_bd_pins CoarseTreeDistributor_0/reset] \
  [get_bd_pins StartStopGenerator_0/reset] [get_bd_pins Sync/reset_TDC]
connect_bd_net [get_bd_pins util_vector_logic_0/Res] [get_bd_pins Res]
connect_bd_net [get_bd_pins util_vector_logic_1/Res] [get_bd_pins util_vector_logic_0/Op1]
connect_bd_net [get_bd_pins xlconcat_0/dout] [get_bd_pins dout]
connect_bd_net [get_bd_pins xlslice_0/Dout] [get_bd_pins Sync/write_reg]
connect_bd_net [get_bd_pins xlslice_1/Dout] [get_bd_pins Ch1/write_reg]
connect_bd_net [get_bd_pins xlslice_2/Dout] [get_bd_pins Ch2/write_reg]

current_bd_instance /TDC_Calib/TDC/Ch1
connect_bd_intf_net [get_bd_intf_pins M00_BB] [get_bd_intf_pins BeltBus_TDL_Channel_1/M00_BB]
connect_bd_intf_net [get_bd_intf_pins M01_AXIS_DebugCT] [get_bd_intf_pins BeltBus_TDL_Channel_1/M01_AXIS_DebugCT]
connect_bd_intf_net [get_bd_intf_pins ch1_diff] [get_bd_intf_pins InputLogic_1/AsyncEventIn_Diff]
connect_bd_intf_net [get_bd_intf_pins S00_BB] [get_bd_intf_pins BeltBus_TDL_Channel_1/S00_BB]
connect_bd_net -net AsyncInput_1 [get_bd_pins InputLogic_1/AsyncEventOut] [get_bd_pins BeltBus_TDL_Channel_1/AsyncInput]
connect_bd_net -net BeltBus_TDL_Channel_TDC_1_Calibrated [get_bd_pins BeltBus_TDL_Channel_1/Calibrated] \
  [get_bd_pins Calibrated] [get_bd_pins InputLogic_1/IsCalibrate] [get_bd_pins TDCChannelSlice_1/Calibrated]
connect_bd_net [get_bd_pins CoarseCounter_CTD] [get_bd_pins BeltBus_TDL_Channel_1/CoarseCounter_CTD]
connect_bd_net -net StartStopGenerator_0_StopOut [get_bd_pins CalibEventIn] [get_bd_pins InputLogic_1/CalibEventIn]
connect_bd_net [get_bd_pins TDCChannelSlice_1/Divider] [get_bd_pins InputLogic_1/Divider]
connect_bd_net [get_bd_pins TDCChannelSlice_1/EdgeTrigger] [get_bd_pins InputLogic_1/EdgeTrigger]
connect_bd_net [get_bd_pins TDCChannelSlice_1/ForceCalibrate] [get_bd_pins InputLogic_1/ForceCalibrate]
connect_bd_net [get_bd_pins TDCChannelSlice_1/Gate] [get_bd_pins InputLogic_1/Gate]
connect_bd_net [get_bd_pins TDCChannelSlice_1/StretchLength] [get_bd_pins InputLogic_1/StretchLength]
connect_bd_net [get_bd_pins TDCChannelSlice_1/read_reg] [get_bd_pins read_reg]
connect_bd_net -net bitTrn_Cal_dout_1 [get_bd_pins xlconstant_1/dout] \
  [get_bd_pins BeltBus_TDL_Channel_1/bitTrn_Cal_dout] [get_bd_pins BeltBus_TDL_Channel_1/bitTrn_ReqSample] \
  [get_bd_pins BeltBus_TDL_Channel_1/bitTrn_Uncal_addr]
connect_bd_net [get_bd_pins clk_BB] \
  [get_bd_pins BeltBus_TDL_Channel_1/clk_BB] [get_bd_pins BeltBus_TDL_Channel_1/clk_SYS] [get_bd_pins TDCChannelSlice_1/aclk] \
  [get_bd_pins TDCChannelSlice_1/clk_BB] [get_bd_pins TDCChannelSlice_1/clk_SYS]
connect_bd_net [get_bd_pins clk_TDC] \
  [get_bd_pins BeltBus_TDL_Channel_1/clk_TDC] [get_bd_pins InputLogic_1/clk] [get_bd_pins TDCChannelSlice_1/clk_TDC]
connect_bd_net [get_bd_pins reset_TDC] \
  [get_bd_pins BeltBus_TDL_Channel_1/reset_BB] [get_bd_pins BeltBus_TDL_Channel_1/reset_SYS] \
  [get_bd_pins BeltBus_TDL_Channel_1/reset_TDC] [get_bd_pins InputLogic_1/reset]
connect_bd_net [get_bd_pins xlconstant_0/dout] \
  [get_bd_pins BeltBus_TDL_Channel_1/Restart_Calibration] [get_bd_pins BeltBus_TDL_Channel_1/Stop_Calibration] \
  [get_bd_pins TDCChannelSlice_1/s00_axis_period_tvalid]
connect_bd_net -net xlslice_1_Dout [get_bd_pins write_reg] [get_bd_pins TDCChannelSlice_1/write_reg]

current_bd_instance /TDC_Calib/TDC/Ch2
connect_bd_intf_net [get_bd_intf_pins M00_BB] [get_bd_intf_pins BeltBus_TDL_Channel_2/M00_BB]
connect_bd_intf_net [get_bd_intf_pins S00_BB] [get_bd_intf_pins BeltBus_TDL_Channel_2/S00_BB]
connect_bd_intf_net [get_bd_intf_pins M01_AXIS_DebugCT] [get_bd_intf_pins BeltBus_TDL_Channel_2/M01_AXIS_DebugCT]
connect_bd_intf_net [get_bd_intf_pins ch2_diff] [get_bd_intf_pins InputLogic_2/AsyncEventIn_Diff]
connect_bd_net -net BeltBus_TDL_Channel_TDC_2_Calibrated [get_bd_pins BeltBus_TDL_Channel_2/Calibrated] \
  [get_bd_pins Calibrated] [get_bd_pins InputLogic_2/IsCalibrate] [get_bd_pins TDCChannelSlice_2/Calibrated]
connect_bd_net [get_bd_pins CoarseCounter_CTD] [get_bd_pins BeltBus_TDL_Channel_2/CoarseCounter_CTD]
connect_bd_net [get_bd_pins InputLogic_2/AsyncEventOut] [get_bd_pins BeltBus_TDL_Channel_2/AsyncInput]
connect_bd_net -net StartStopGenerator_0_StopOut [get_bd_pins CalibEventIn] [get_bd_pins InputLogic_2/CalibEventIn]
connect_bd_net [get_bd_pins TDCChannelSlice_2/Divider] [get_bd_pins InputLogic_2/Divider]
connect_bd_net [get_bd_pins TDCChannelSlice_2/EdgeTrigger] [get_bd_pins InputLogic_2/EdgeTrigger]
connect_bd_net [get_bd_pins TDCChannelSlice_2/ForceCalibrate] [get_bd_pins InputLogic_2/ForceCalibrate]
connect_bd_net [get_bd_pins TDCChannelSlice_2/Gate] [get_bd_pins InputLogic_2/Gate]
connect_bd_net [get_bd_pins TDCChannelSlice_2/StretchLength] [get_bd_pins InputLogic_2/StretchLength]
connect_bd_net [get_bd_pins TDCChannelSlice_2/read_reg] [get_bd_pins read_reg]
connect_bd_net -net bitTrn_Cal_dout_1 [get_bd_pins xlconstant_1/dout] \
  [get_bd_pins BeltBus_TDL_Channel_2/bitTrn_Cal_dout] [get_bd_pins BeltBus_TDL_Channel_2/bitTrn_ReqSample] \
  [get_bd_pins BeltBus_TDL_Channel_2/bitTrn_Uncal_addr]
connect_bd_net [get_bd_pins clk_BB] \
  [get_bd_pins BeltBus_TDL_Channel_2/clk_BB] [get_bd_pins BeltBus_TDL_Channel_2/clk_SYS] [get_bd_pins TDCChannelSlice_2/aclk] \
  [get_bd_pins TDCChannelSlice_2/clk_BB] [get_bd_pins TDCChannelSlice_2/clk_SYS]
connect_bd_net [get_bd_pins clk_TDC] \
  [get_bd_pins BeltBus_TDL_Channel_2/clk_TDC] [get_bd_pins InputLogic_2/clk] [get_bd_pins TDCChannelSlice_2/clk_TDC]
connect_bd_net [get_bd_pins reset_TDC] \
  [get_bd_pins BeltBus_TDL_Channel_2/reset_BB] [get_bd_pins BeltBus_TDL_Channel_2/reset_SYS] \
  [get_bd_pins BeltBus_TDL_Channel_2/reset_TDC] [get_bd_pins InputLogic_2/reset]
connect_bd_net [get_bd_pins xlconstant_0/dout] \
  [get_bd_pins BeltBus_TDL_Channel_2/Restart_Calibration] [get_bd_pins BeltBus_TDL_Channel_2/Stop_Calibration] \
  [get_bd_pins TDCChannelSlice_2/s00_axis_period_tvalid]
connect_bd_net -net xlslice_2_Dout [get_bd_pins write_reg] [get_bd_pins TDCChannelSlice_2/write_reg]

current_bd_instance /TDC_Calib/TDC/Sync
connect_bd_intf_net [get_bd_intf_pins AXI4Stream_PeriodMet_0/S00_BB] [get_bd_intf_pins BeltBus_TDL_Channel_0/M00_AXIS]
connect_bd_intf_net [get_bd_intf_pins M01_AXIS_DebugCT] [get_bd_intf_pins BeltBus_TDL_Channel_0/M01_AXIS_DebugCT]
connect_bd_intf_net [get_bd_intf_pins M00_BB] [get_bd_intf_pins BeltBus_TDL_Channel_0/M00_BB]
connect_bd_intf_net [get_bd_intf_pins AXI4Stream_PeriodMet_0/M00_AXIS] [get_bd_intf_pins axis_broadcaster_0/S_AXIS]
connect_bd_intf_net [get_bd_intf_pins sync_diff] [get_bd_intf_pins InputLogic_0/AsyncEventIn_Diff]
connect_bd_intf_net [get_bd_intf_pins M00_AXIS] [get_bd_intf_pins axis_broadcaster_0/M00_AXIS]
connect_bd_intf_net [get_bd_intf_pins TDCChannelSlice_0/S00_AXIS_Period] [get_bd_intf_pins axis_broadcaster_0/M01_AXIS]
connect_bd_net -net AsyncInput_1 [get_bd_pins InputLogic_0/AsyncEventOut] [get_bd_pins BeltBus_TDL_Channel_0/AsyncInput]
connect_bd_net -net BeltBus_TDL_Channel_TDC_0_Calibrated [get_bd_pins BeltBus_TDL_Channel_0/Calibrated] \
  [get_bd_pins Calibrated] [get_bd_pins InputLogic_0/IsCalibrate] [get_bd_pins TDCChannelSlice_0/Calibrated]
connect_bd_net [get_bd_pins CoarseCounter_CTD] [get_bd_pins BeltBus_TDL_Channel_0/CoarseCounter_CTD]
connect_bd_net -net StartStopGenerator_0_StartOut [get_bd_pins CalibEventIn] [get_bd_pins InputLogic_0/CalibEventIn]
connect_bd_net [get_bd_pins TDCChannelSlice_0/Divider] [get_bd_pins InputLogic_0/Divider]
connect_bd_net [get_bd_pins TDCChannelSlice_0/EdgeTrigger] [get_bd_pins InputLogic_0/EdgeTrigger]
connect_bd_net [get_bd_pins TDCChannelSlice_0/ForceCalibrate] [get_bd_pins InputLogic_0/ForceCalibrate]
connect_bd_net [get_bd_pins TDCChannelSlice_0/Gate] [get_bd_pins InputLogic_0/Gate]
connect_bd_net [get_bd_pins TDCChannelSlice_0/StretchLength] [get_bd_pins InputLogic_0/StretchLength]
connect_bd_net [get_bd_pins TDCChannelSlice_0/read_reg] [get_bd_pins read_reg]
connect_bd_net -net bitTrn_Cal_dout_1 [get_bd_pins xlconstant_1/dout] \
  [get_bd_pins BeltBus_TDL_Channel_0/bitTrn_Cal_dout] [get_bd_pins BeltBus_TDL_Channel_0/bitTrn_ReqSample] \
  [get_bd_pins BeltBus_TDL_Channel_0/bitTrn_Uncal_addr]
connect_bd_net [get_bd_pins clk_BB] \
  [get_bd_pins AXI4Stream_PeriodMet_0/clk] [get_bd_pins BeltBus_TDL_Channel_0/clk_BB] \
  [get_bd_pins BeltBus_TDL_Channel_0/clk_SYS] [get_bd_pins TDCChannelSlice_0/aclk] [get_bd_pins TDCChannelSlice_0/clk_BB] \
  [get_bd_pins TDCChannelSlice_0/clk_SYS] [get_bd_pins axis_broadcaster_0/aclk]
connect_bd_net [get_bd_pins clk_TDC] \
  [get_bd_pins BeltBus_TDL_Channel_0/clk_TDC] [get_bd_pins InputLogic_0/clk] [get_bd_pins TDCChannelSlice_0/clk_TDC]
connect_bd_net -net reset_0_1 [get_bd_pins reset_0] [get_bd_pins axis_broadcaster_0/aresetn] [get_bd_pins util_vector_logic_0/Op1]
connect_bd_net [get_bd_pins reset_TDC] \
  [get_bd_pins BeltBus_TDL_Channel_0/reset_BB] [get_bd_pins BeltBus_TDL_Channel_0/reset_SYS] \
  [get_bd_pins BeltBus_TDL_Channel_0/reset_TDC] [get_bd_pins InputLogic_0/reset]
connect_bd_net [get_bd_pins util_vector_logic_0/Res] [get_bd_pins AXI4Stream_PeriodMet_0/reset]
connect_bd_net [get_bd_pins xlconstant_0/dout] \
  [get_bd_pins BeltBus_TDL_Channel_0/Restart_Calibration] [get_bd_pins BeltBus_TDL_Channel_0/Stop_Calibration]
connect_bd_net -net xlslice_0_Dout [get_bd_pins write_reg] [get_bd_pins TDCChannelSlice_0/write_reg]

current_bd_instance /
connect_bd_intf_net [get_bd_intf_ports ch1_diff] [get_bd_intf_pins TDC_Calib/ch1_diff]
connect_bd_intf_net [get_bd_intf_ports ch2_diff] [get_bd_intf_pins TDC_Calib/ch2_diff]
connect_bd_intf_net [get_bd_intf_ports FRONT_GREEN_POWER_LED] [get_bd_intf_pins dlconstant_gpio_1/constant_out]
connect_bd_intf_net [get_bd_intf_ports FT_245_EN_BUS] [get_bd_intf_pins dlconstant_gpio_2/constant_out]
connect_bd_intf_net [get_bd_intf_pins BeltBus_LedCounter_0/BeltBus] [get_bd_intf_pins axis_broadcaster_0/M03_AXIS]
connect_bd_intf_net [get_bd_intf_pins BeltBus_TTM_0/S00_BB] [get_bd_intf_pins axis_broadcaster_0/M04_AXIS]
connect_bd_intf_net [get_bd_intf_pins BeltBus_TDCHistogrammer_1/M00_AXIS] [get_bd_intf_pins axis_interconnect_0/S02_AXIS]
connect_bd_intf_net [get_bd_intf_pins IIC/S00_AXI] [get_bd_intf_pins axi_interconnect_0/M05_AXI]
connect_bd_intf_net [get_bd_intf_pins BitstreamUpdater_QSPI/S00_AXI] [get_bd_intf_pins axi_interconnect_0/M06_AXI]
connect_bd_intf_net [get_bd_intf_pins axi_interconnect_0/M07_AXI] [get_bd_intf_pins xadc_wiz_0/s_axi_lite]
connect_bd_intf_net -intf_net axi_quad_spi_0_SPI_0 [get_bd_intf_ports QSPI_MEMORY_IF] [get_bd_intf_pins BitstreamUpdater_QSPI/QSPI_MEMORY_IF]
connect_bd_intf_net [get_bd_intf_pins BeltBus_TTM_0/S00_AXI] [get_bd_intf_pins axi_interconnect_0/M08_AXI]
connect_bd_intf_net [get_bd_intf_pins TDC_Calib/S00_AXI] [get_bd_intf_pins axi_interconnect_0/M04_AXI]
connect_bd_intf_net -intf_net axi_iic_0_IIC [get_bd_intf_ports I2C_BUS] [get_bd_intf_pins IIC/I2C_BUS]
connect_bd_intf_net [get_bd_intf_pins TDC_Calib/M00_AXIS] [get_bd_intf_pins axis_broadcaster_1/S_AXIS]
connect_bd_intf_net [get_bd_intf_pins Master/S_AXI] [get_bd_intf_pins axi_interconnect_0/M00_AXI]
connect_bd_intf_net [get_bd_intf_pins TDC_Calib/M00_AXIS_Autopush] [get_bd_intf_pins axis_interconnect_0/S03_AXIS]
connect_bd_intf_net [get_bd_intf_pins BeltBus_TDCHistogrammer_0/M00_AXIS] [get_bd_intf_pins axis_interconnect_0/S01_AXIS]
connect_bd_intf_net [get_bd_intf_pins MME_0/M_AXI_S2MM] [get_bd_intf_pins axi_interconnect_0/S01_AXI]
connect_bd_intf_net [get_bd_intf_pins MME_0/M_AXI_MM2S] [get_bd_intf_pins axi_interconnect_0/S00_AXI]
connect_bd_intf_net [get_bd_intf_pins AXI4Stream_FT245Sync_0/s00_axis_TX] [get_bd_intf_pins MME_0/M_AXIS]
connect_bd_intf_net -intf_net FT245_1 [get_bd_intf_ports FT245] [get_bd_intf_pins AXI4Stream_FT245Sync_0/FT245]
connect_bd_intf_net [get_bd_intf_pins BeltBus_TTM_0/M00_AXIS] [get_bd_intf_pins MME_0/PTE_INPUT]
connect_bd_intf_net [get_bd_intf_pins BeltBus_TDCCounter_0/M00_AXIS_Push] [get_bd_intf_pins axis_interconnect_0/S00_AXIS]
connect_bd_intf_net [get_bd_intf_ports LED_R_BUS] [get_bd_intf_pins BeltBus_LedCounter_0/RED_LEDS]
connect_bd_intf_net [get_bd_intf_ports LED_G_BUS] [get_bd_intf_pins BeltBus_LedCounter_0/GREEN_LEDS]
connect_bd_intf_net [get_bd_intf_pins AXI4Stream_FT245Sync_0/m00_axis_RX] [get_bd_intf_pins MME_0/S_AXIS]
connect_bd_intf_net [get_bd_intf_pins BeltBus_TDCCounter_0/S00_AXI] [get_bd_intf_pins axi_interconnect_0/M01_AXI]
connect_bd_intf_net -intf_net TDC_M00_BB [get_bd_intf_pins TDC_Calib/M00_BB] [get_bd_intf_pins axis_broadcaster_0/S_AXIS]
connect_bd_intf_net [get_bd_intf_pins BeltBus_TDCHistogrammer_0/S00_AXI] [get_bd_intf_pins axi_interconnect_0/M02_AXI]
connect_bd_intf_net [get_bd_intf_pins BeltBus_TDCHistogrammer_1/S00_AXI] [get_bd_intf_pins axi_interconnect_0/M03_AXI]
connect_bd_intf_net [get_bd_intf_pins BeltBus_TDCCounter_0/S00_BB] [get_bd_intf_pins axis_broadcaster_0/M00_AXIS]
connect_bd_intf_net [get_bd_intf_pins BeltBus_TDCHistogrammer_0/S00_BELT] [get_bd_intf_pins axis_broadcaster_0/M01_AXIS]
connect_bd_intf_net [get_bd_intf_pins BeltBus_TDCHistogrammer_1/S00_BELT] [get_bd_intf_pins axis_broadcaster_0/M02_AXIS]
connect_bd_intf_net [get_bd_intf_ports DAC_RESETN] [get_bd_intf_pins dlconstant_gpio_3/constant_out]
connect_bd_intf_net [get_bd_intf_ports sync_diff] [get_bd_intf_pins TDC_Calib/sync_diff]
connect_bd_intf_net [get_bd_intf_ports sys_diff_clock] [get_bd_intf_pins clk_wiz_0/CLK_IN1_D]
connect_bd_intf_net [get_bd_intf_ports tdc_diff_clock] [get_bd_intf_pins TDC_Calib/tdc_diff_clock]
connect_bd_intf_net [get_bd_intf_pins BeltBus_TDCHistogrammer_1/SYNC] [get_bd_intf_pins axis_broadcaster_1/M01_AXIS]
connect_bd_intf_net [get_bd_intf_pins MME_0/S_AXIS_AUX] [get_bd_intf_pins axis_interconnect_0/M00_AXIS]
connect_bd_intf_net [get_bd_intf_pins BeltBus_TDCHistogrammer_0/SYNC] [get_bd_intf_pins axis_broadcaster_1/M00_AXIS]
connect_bd_intf_net [get_bd_intf_ports USB_UART_BUS_EN] [get_bd_intf_pins dlconstant_gpio_0/constant_out]
connect_bd_net [get_bd_pins TDC_Calib/Res] [get_bd_pins BeltBus_LedCounter_0/is_calibrated]
connect_bd_net [get_bd_pins clk_wiz_0/clk_out1] \
  [get_bd_pins AXI4Stream_FT245Sync_0/m00_axis_RX_clk] [get_bd_pins AXI4Stream_FT245Sync_0/s00_axis_TX_clk] \
  [get_bd_pins BeltBus_LedCounter_0/clk] [get_bd_pins BeltBus_LedCounter_0/s00_bb_aclk] \
  [get_bd_pins BeltBus_TDCCounter_0/s00_axi_aclk] [get_bd_pins BeltBus_TDCCounter_0/s00_bb_aclk] \
  [get_bd_pins BeltBus_TDCHistogrammer_0/m00_axis_aclk] [get_bd_pins BeltBus_TDCHistogrammer_0/s00_axi_aclk] \
  [get_bd_pins BeltBus_TDCHistogrammer_0/s00_belt_aclk] [get_bd_pins BeltBus_TDCHistogrammer_1/m00_axis_aclk] \
  [get_bd_pins BeltBus_TDCHistogrammer_1/s00_axi_aclk] [get_bd_pins BeltBus_TDCHistogrammer_1/s00_belt_aclk] \
  [get_bd_pins BeltBus_TTM_0/s00_axi_clk] [get_bd_pins BeltBus_TTM_0/s00_bb_clk] [get_bd_pins BitstreamUpdater_QSPI/aclk] \
  [get_bd_pins IIC/s00_axi_aclk] [get_bd_pins MME_0/clk] [get_bd_pins Master/s_axi_aclk] [get_bd_pins TDC_Calib/clk_BB] \
  [get_bd_pins axi_interconnect_0/ACLK] [get_bd_pins axi_interconnect_0/M00_ACLK] [get_bd_pins axi_interconnect_0/M01_ACLK] \
  [get_bd_pins axi_interconnect_0/M02_ACLK] [get_bd_pins axi_interconnect_0/M03_ACLK] \
  [get_bd_pins axi_interconnect_0/M04_ACLK] [get_bd_pins axi_interconnect_0/M05_ACLK] \
  [get_bd_pins axi_interconnect_0/M06_ACLK] [get_bd_pins axi_interconnect_0/M07_ACLK] \
  [get_bd_pins axi_interconnect_0/M08_ACLK] [get_bd_pins axi_interconnect_0/S00_ACLK] \
  [get_bd_pins axi_interconnect_0/S01_ACLK] [get_bd_pins axis_broadcaster_0/aclk] [get_bd_pins axis_broadcaster_1/aclk] \
  [get_bd_pins axis_interconnect_0/ACLK] [get_bd_pins axis_interconnect_0/M00_AXIS_ACLK] \
  [get_bd_pins axis_interconnect_0/S00_AXIS_ACLK] [get_bd_pins axis_interconnect_0/S01_AXIS_ACLK] \
  [get_bd_pins axis_interconnect_0/S02_AXIS_ACLK] [get_bd_pins axis_interconnect_0/S03_AXIS_ACLK] \
  [get_bd_pins proc_sys_reset_0/slowest_sync_clk] [get_bd_pins xadc_wiz_0/s_axi_aclk]
connect_bd_net [get_bd_pins clk_wiz_0/clk_out2] [get_bd_pins BitstreamUpdater_QSPI/ext_spi_clk]
connect_bd_net [get_bd_pins clk_wiz_0/locked] [get_bd_pins proc_sys_reset_0/dcm_locked]
connect_bd_net [get_bd_pins clk_wiz_1/ft_clk] [get_bd_pins AXI4Stream_FT245Sync_0/clk_FT245]
connect_bd_net [get_bd_ports ftdi_clock] [get_bd_pins clk_wiz_1/clk_in1]
connect_bd_net [get_bd_pins proc_sys_reset_0/interconnect_aresetn] \
  [get_bd_pins MME_0/interconnect_aresetn] [get_bd_pins axi_interconnect_0/ARESETN] [get_bd_pins axis_interconnect_0/ARESETN]
connect_bd_net [get_bd_pins proc_sys_reset_0/peripheral_aresetn] \
  [get_bd_pins AXI4Stream_FT245Sync_0/s00_axis_TX_resetn] [get_bd_pins BeltBus_LedCounter_0/s00_bb_aresetn] \
  [get_bd_pins BeltBus_TDCCounter_0/s00_axi_aresetn] [get_bd_pins BeltBus_TDCCounter_0/s00_bb_aresetn] \
  [get_bd_pins BeltBus_TDCHistogrammer_0/m00_axis_aresetn] [get_bd_pins BeltBus_TDCHistogrammer_0/s00_axi_aresetn] \
  [get_bd_pins BeltBus_TDCHistogrammer_0/s00_belt_aresetn] [get_bd_pins BeltBus_TDCHistogrammer_1/m00_axis_aresetn] \
  [get_bd_pins BeltBus_TDCHistogrammer_1/s00_axi_aresetn] [get_bd_pins BeltBus_TDCHistogrammer_1/s00_belt_aresetn] \
  [get_bd_pins BeltBus_TTM_0/s00_axi_aresetn] [get_bd_pins BeltBus_TTM_0/s00_bb_aresetn] \
  [get_bd_pins BitstreamUpdater_QSPI/aresetn] [get_bd_pins IIC/s00_axi_aresetn] [get_bd_pins MME_0/peripherals_aresetn] \
  [get_bd_pins Master/s_axi_aresetn] [get_bd_pins TDC_Calib/reset_0] [get_bd_pins TDC_Calib/resetn] \
  [get_bd_pins axi_interconnect_0/M00_ARESETN] [get_bd_pins axi_interconnect_0/M01_ARESETN] \
  [get_bd_pins axi_interconnect_0/M02_ARESETN] [get_bd_pins axi_interconnect_0/M03_ARESETN] \
  [get_bd_pins axi_interconnect_0/M04_ARESETN] [get_bd_pins axi_interconnect_0/M05_ARESETN] \
  [get_bd_pins axi_interconnect_0/M06_ARESETN] [get_bd_pins axi_interconnect_0/M07_ARESETN] \
  [get_bd_pins axi_interconnect_0/M08_ARESETN] [get_bd_pins axi_interconnect_0/S00_ARESETN] \
  [get_bd_pins axi_interconnect_0/S01_ARESETN] [get_bd_pins axis_broadcaster_0/aresetn] \
  [get_bd_pins axis_broadcaster_1/aresetn] [get_bd_pins axis_interconnect_0/M00_AXIS_ARESETN] \
  [get_bd_pins axis_interconnect_0/S00_AXIS_ARESETN] [get_bd_pins axis_interconnect_0/S01_AXIS_ARESETN] \
  [get_bd_pins axis_interconnect_0/S02_AXIS_ARESETN] [get_bd_pins axis_interconnect_0/S03_AXIS_ARESETN] \
  [get_bd_pins xadc_wiz_0/s_axi_aresetn]
connect_bd_net [get_bd_pins proc_sys_reset_0/peripheral_reset] [get_bd_pins BeltBus_LedCounter_0/reset] [get_bd_pins TDC_Calib/reset]
connect_bd_net [get_bd_pins xlconstant_0/dout] [get_bd_pins AXI4Stream_FT245Sync_0/areset]
connect_bd_net [get_bd_pins xlconstant_1/dout] [get_bd_pins proc_sys_reset_0/ext_reset_in]
